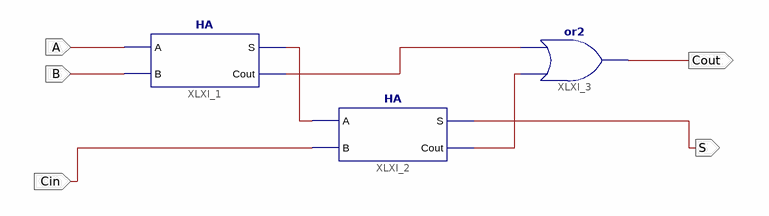
[diagram p0: schematic sheet 1]
// Xilinx ISE schematic FA.sch (spartan3e) as structural Verilog: 3 symbols, 5 ports
module FA (
  input  Cin,
  input  B,
  input  A,
  output S,
  output Cout
);

  wire XLXN_6, XLXN_22, XLXN_23;

  HA XLXI_1 (.A(A), .B(B), .Cout(XLXN_23), .S(XLXN_22));
  HA XLXI_2 (.A(XLXN_22), .B(Cin), .Cout(XLXN_6), .S(S));
  or XLXI_3 (Cout, XLXN_6, XLXN_23);
endmodule
